# Altium schematic sheet Power Supplies.SchDoc: DaughterBoard Tester
size Letter; DrawnBy: MTAN; Organization: Altium Limited; DocumentNumber: 5; Revision: A; SheetNumber: 5; SheetTotal: 6
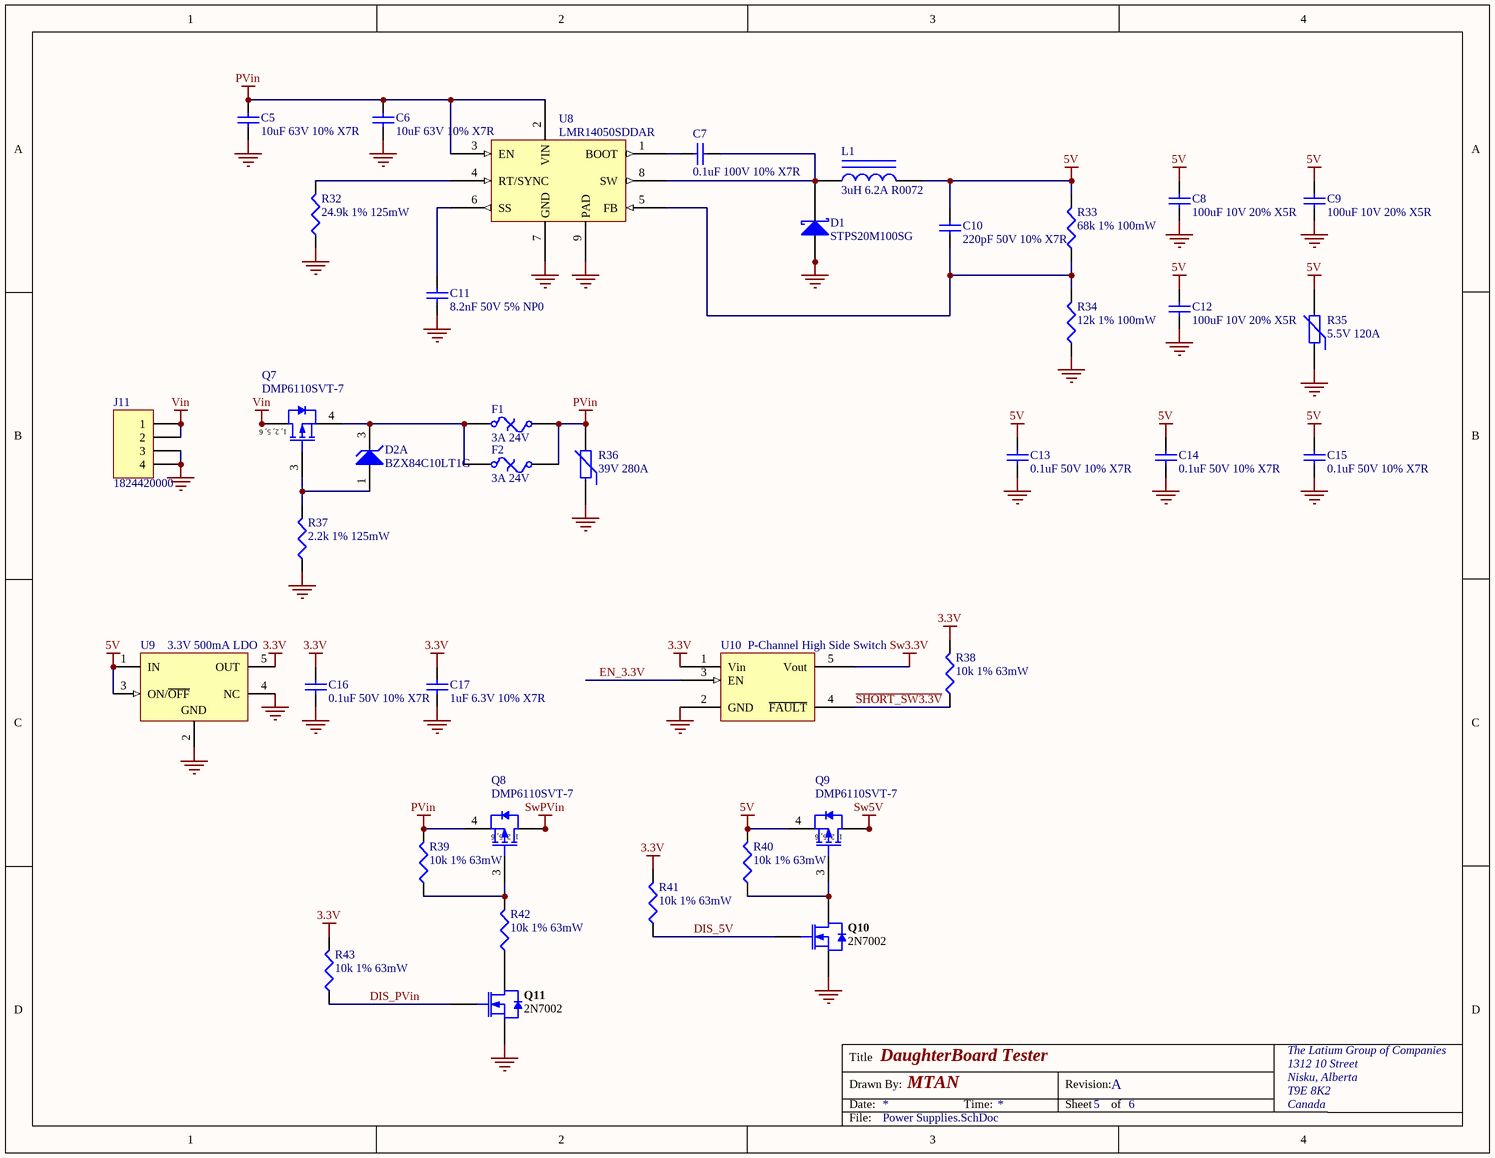
[diagram p0: Power Supplies.SchDoc]

## Parts
C5  10uF 63V 10% X7R  [C1210_L]
C6  10uF 63V 10% X7R  [C1210_L]
C7  0.1uF 100V 10% X7R  [C0805]
C8  100uF 10V 20% X5R  [C1210_L]
C9  100uF 10V 20% X5R  [C1210_L]
C10  220pF 50V 10% X7R  [1608[0603]]
C11  8.2nF 50V 5% NP0  [1608[0603]]
C12  100uF 10V 20% X5R  [C1210_L]
C13  0.1uF 50V 10% X7R  [CAPC1005L]
C14  0.1uF 50V 10% X7R  [CAPC1005L]
C15  0.1uF 50V 10% X7R  [CAPC1005L]
C16  0.1uF 50V 10% X7R  [CAPC1005L]
C17  1uF 6.3V 10% X7R  [CAPC1005L]
D1  STPS20M100SG  [ONSC-D2PAK-3-418AJ_A_V]
D2  BZX84C10LT1G  [SOT23-3_L]  (part A of 2)
F1  3A 24V  [2920]
F2  3A 24V  [2920]
J11  1824420000  [1824420000]
L1  3uH 6.2A R0072  [SRU1048]
Q7  DMP6110SVT-7  [SOT23-6_L]
Q8  DMP6110SVT-7  [SOT23-6_L]
Q9  DMP6110SVT-7  [SOT23-6_L]
Q10  2N7002  [INF-PG-SOT23_L]
Q11  2N7002  [INF-PG-SOT23_L]
R32  24.9k 1% 125mW  [6-0805_L]
R33  68k 1% 100mW  [J1-0603]
R34  12k 1% 100mW  [J1-0603]
R35  5.5V 120A  [6-0805_L]
R36  39V 280A  [RESC3225L]
R37  2.2k 1% 125mW  [6-0805_L]
R38  10k 1% 63mW  [RESC1005L]
R39  10k 1% 63mW  [RESC1005L]
R40  10k 1% 63mW  [RESC1005L]
R41  10k 1% 63mW  [RESC1005L]
R42  10k 1% 63mW  [RESC1005L]
R43  10k 1% 63mW  [RESC1005L]
U8  LMR14050SDDAR  [MRA08A_L]
U9  3.3V 500mA LDO  [MF05A_L]
U10  P-Channel High Side Switch  [SOT23-5_L]

## Nets
3.3V: C16.1 C17.1 R38.2 R41.2 R43.2 U9.5(OUT) U10.1(Vin)
5V: C8.2 C9.2 C10.2 C12.2 C13.1 C14.1 C15.1 L1.2 Q9.4(S) R33.2 R35.2 R40.2 U9.1(IN) U9.3(ON/~{OFF})
GND: C5.1 C6.1 C8.1 C9.1 C11.1 C12.1 C13.2 C14.2 C15.2 C16.2 C17.2 D1.1(A) D1.3(A) J11.3 J11.4 Q10.2(SOURCE) Q11.2(SOURCE) R32.1 R34.1 R35.1 R36.1 R37.1 U8.7(GND) U8.9(PAD) U9.2(GND) U9.4(NC) U10.2(GND)
PVin: C5.2 C6.2 F1.2 F2.2 Q8.4(S) R36.2 R39.2 U8.2(VIN) U8.3(EN)
Sw3.3V: U10.5(Vout)
Sw5V: Q9.1(D) Q9.2(D) Q9.5(D) Q9.6(D)
SwPVin: Q8.1(D) Q8.2(D) Q8.5(D) Q8.6(D)
Vin: J11.1 J11.2 Q7.1(D) Q7.2(D) Q7.5(D) Q7.6(D)
DIS_5V: Q10.1(GATE) R41.1
DIS_PVin: Q11.1(GATE) R43.1
EN_3.3V: U10.3(EN)
~{SHORT_SW3.3V}: R38.1 U10.4(~{FAULT})
NetC7_1: C7.1 D1.4(K) L1.1 U8.8(SW)
NetC7_2: C7.2 U8.1(BOOT)
NetC10_1: C10.1 R33.1 R34.2 U8.5(FB)
NetC11_2: C11.2 U8.6(SS)
NetD2_1: D2.1(A) Q7.3(G) R37.2
NetD2_3: D2.3(K) F1.1 F2.1 Q7.4(S)
NetQ8_3: Q8.3(G) R39.1 R42.2
NetQ9_3: Q9.3(G) Q10.3(DRAIN) R40.1
NetQ11_3: Q11.3(DRAIN) R42.1
NetR32_2: R32.2 U8.4(RT/SYNC)

## Notes on the sheet
- Title
- Drawn By:
- Date:
- Time:
- Revision:
- Sheet
- of
- The Latium Group of Companies
- 1312 10 Street
- Nisku, Alberta
- T9E 8K2
- Canada
- File:
- (in symbol NTGS3136PT1G) 1, 2, 5, 6

## Library data of the parts
C5-C17 = Cap: Capacitor
  C5 C6: Value: 10uF 63V 10% X7R
  C7: Value: 0.1uF 100V 10% X7R
  C8 C9 C12: Value: 100uF 10V 20% X5R
  C10: Value: 220pF 50V 10% X7R
  C11: Value: 8.2nF 50V 5% NP0
  C13-C16: Value: 0.1uF 50V 10% X7R
  C17: Value: 1uF 6.3V 10% X7R
D1 = BAS70: DIODE SCHOTTKY 100V 20A D2PAK; Manufacturer: STMicroelectronics; ComponentLink2Description: Datasheet; ComponentLink2URL: S:\Hardware\Data Sheets\Passive\Diodes\STPS20M100.pdf; Value: STPS20M100SG; Manufacturer Part Number: STPS20M100SG; Supplier 1: Digi-Key; Supplier 1 Part Number: 497-10993-1-ND
D2 = BZX84C10LT1G: DIODE ZENER 10V 225MW SOT23-3; Manufacturer: On Semiconductor; Supplier 1: Digi-Key; Supplier 1 Part Number: BZX84C10LT1GOSCT-ND; ComponentLink1Description: Data Sheet; ComponentLink1URL: S:\Hardware\Data Sheets\Passive\Diodes\BZX84C2V4LT1-D.pdf; Value: BZX84C10LT1G; Manufacturer Part Number: BZX84C10LT1G
F1 F2 = Fuse Thermal: Thermal Fuse; Manufacturer Part Number: SMDC300F/24-2; Manufacturer: Littelfuse Inc; Value: 3A 24V; Supplier 1: Digi-Key; Supplier 1 Part Number: SMDC300F/24-2CT-ND
J11 = Header 4H: TERM BLK 2POS SIDE ENT 3.5MM PCB; Manufacturer: Weidmuller; Value: 1824420000; Manufacturer Part Number: 1824420000; Supplier 1: Digi-Key; Supplier 1 Part Number: 281-2020-ND
L1 = Inductor Iron: FIXED IND 3UH 6.2A 7.2 MOHM SMD; Manufacturer Part Number: SRU1048-3R0Y; Manufacturer: Bourns Inc; Value: 3uH 6.2A R0072; Supplier 1: Digi-Key; Supplier 1 Part Number: SRU1048-3R0YCT-ND; ComponentLink1Description: Data Sheet; ComponentLink1URL: S:\Hardware\Data Sheets\Passive\Inductors\SRU1048.pdf
Q7-Q9 = NTGS3136PT1G: MOSFET P-CH 60V TSOT26; Manufacturer: Diodes Incorporated; ComponentLink1Description: Data Sheet; ComponentLink1URL: S:\Hardware\Data Sheets\Passive\FETs\DMP6110SVT.pdf; Value: DMP6110SVT-7; Manufacturer Part Number: DMP6110SVT-7; Supplier 1: Digi-Key; Supplier 1 Part Number: DMP6110SVT-7DICT-ND
Q10 Q11 = 2N7002: MOSFET N-CH 60V 115MA SOT-23; Manufacturer: ON Semiconductor; ComponentLink1Description: Data Sheet; ComponentLink1URL: S:\Hardware\Data Sheets\Active\Transistors\FETs\NDS7002A-D.pdf; Manufacturer Part Number: 2N7002; Value: 2N7002; Supplier 1: Digi-Key; Supplier 1 Part Number: 2N7002NCT-ND
R32-R34 R37-R43 = Res3: Resistor
  R32: Value: 24.9k 1% 125mW
  R33: Value: 68k 1% 100mW
  R34: Value: 12k 1% 100mW
  R37: Value: 2.2k 1% 125mW
  R38-R43: Value: 10k 1% 63mW
R35 = Res Varistor: VARISTOR 8.2V 120A 0805; Manufacturer: Littelfuse Inc; Manufacturer Part Number: V5.5MLA0805H; Value: 5.5V 120A; Supplier 1: Digi-Key; Supplier 1 Part Number: F2215CT-ND
R36 = Res Varistor: VARISTOR 39V 280A 1210; Manufacturer: Littelfuse Inc; Manufacturer Part Number: V30MLA1210NH; Value: 39V 280A; Supplier 1: Digi-Key; Supplier 1 Part Number: F3825CT-ND
U8 = LMR14050: IC REG BUCK ADJUSTABLE 5A 8SOPWR; Manufacturer: Texas Instruments; Value: LMR14050SDDAR; Manufacturer Part Number: LMR14050SDDAR; Supplier 1: Digi-Key; Supplier 1 Part Number: 296-44322-1-ND; ComponentLink1Description: Data Sheet; ComponentLink1URL: S:\Hardware\Data Sheets\Active\Voltage Regulators\lmr14050.pdf
U9 = LP2985AIM5X-6.1/NOPB: IC REG LINEAR 3.3V 500MA SOT23-5; Manufacturer: Texas Instruments; Manufacturer Part Number: TLV75533PDBVR; Value: 3.3V 500mA LDO; Supplier 1: Digi-Key; Supplier 1 Part Number: 296-50411-1-ND
U10 = MIC2005A-1YM5-TR: IC PWR SWITCH P-CHAN 1:1 SOT23-5; Manufacturer: Microchip Technology; Value: P-Channel High Side Switch; Manufacturer Part Number: MIC2005A-1YM5-TR; Supplier 1: Digi-Key; Supplier 1 Part Number: 576-3462-1-ND